# Altium schematic sheet atmega.SchDoc
size A4
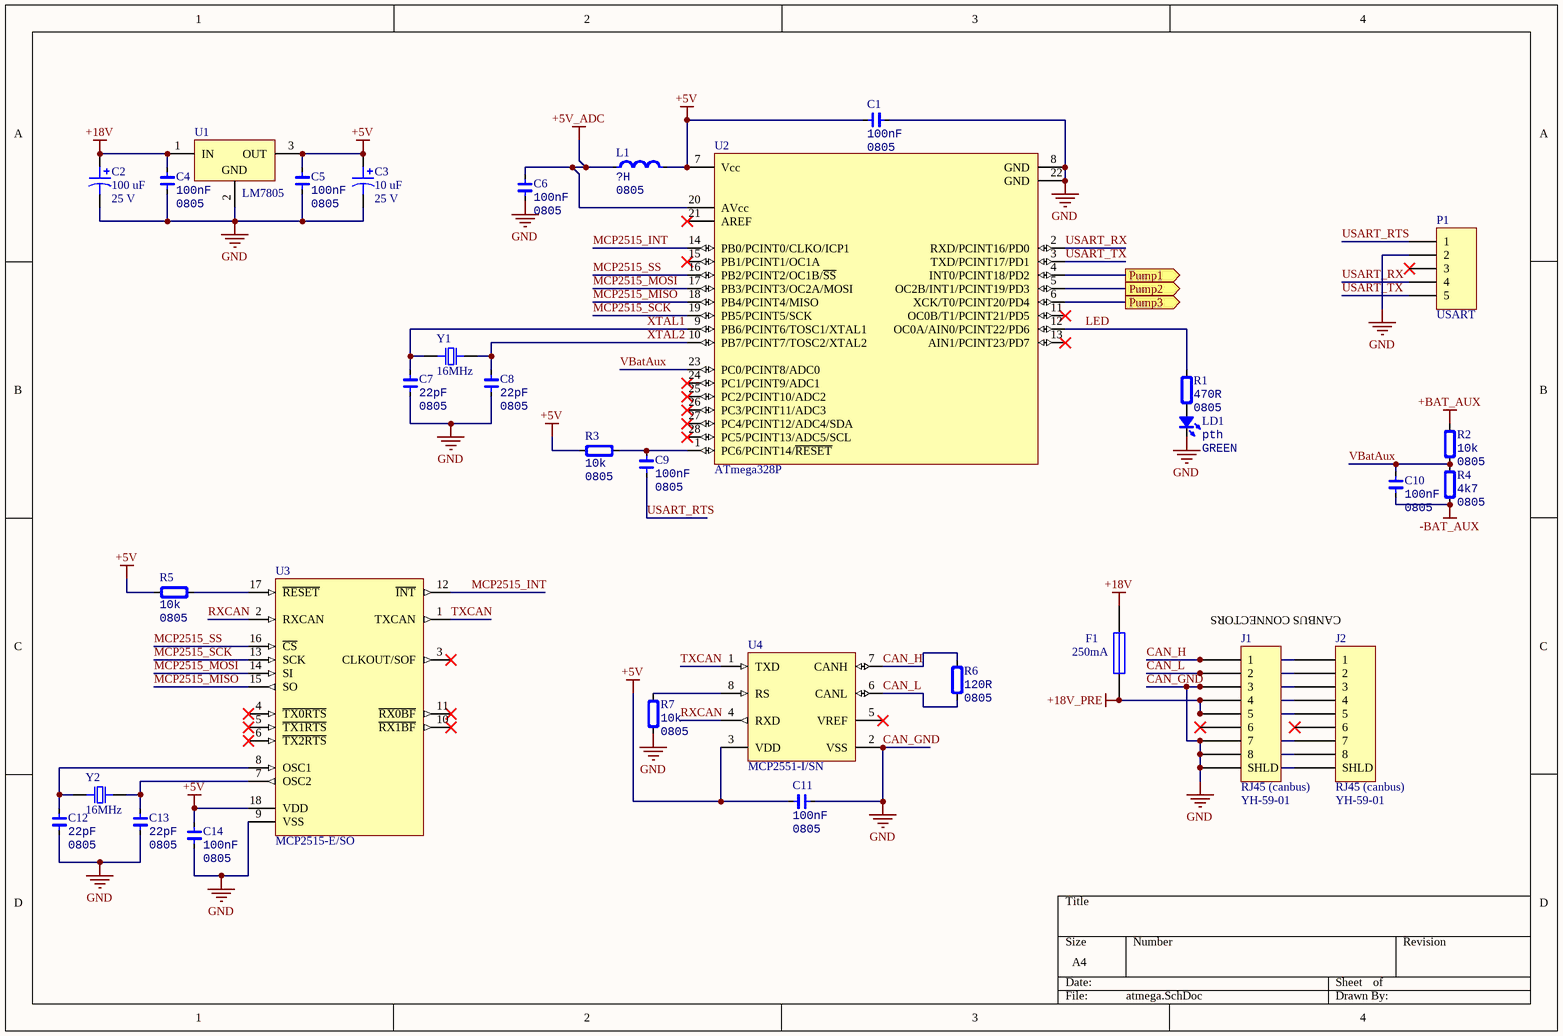
[diagram p0: atmega.SchDoc]

## Parts
C1  Type: 0805  [0805C]  (hidden comment: 100nF)
C2  Voltage: 25 V  [CP3.5mm-8.0mm]  (hidden comment: 100 uF)
C3  Voltage: 25 V  [CP3.5mm-8.0mm]  (hidden comment: 10 uF)
C4  Type: 0805  [0805C]  (hidden comment: 100nF)
C5  Type: 0805  [0805C]  (hidden comment: 100nF)
C6  Type: 0805  [0805C]  (hidden comment: 100nF)
C7  Type: 0805  [0805C]  (hidden comment: 22pF)
C8  Type: 0805  [0805C]  (hidden comment: 22pF)
C9  Type: 0805  [0805C]  (hidden comment: 100nF)
C10  Type: 0805  [0805C]  (hidden comment: 100nF)
C11  Type: 0805  [0805C]  (hidden comment: 100nF)
C12  Type: 0805  [0805C]  (hidden comment: 22pF)
C13  Type: 0805  [0805C]  (hidden comment: 22pF)
C14  Type: 0805  [0805C]  (hidden comment: 100nF)
F1  250mA  [Porta Fusivel]
J1  RJ45 (canbus)  value YH-59-01  [ASSMANN A-2004-2-4-LP/FS]
J2  RJ45 (canbus)  value YH-59-01  [ASSMANN A-2004-2-4-LP/FS]
L1  Type: 0805  [0805L]  (hidden comment: ?H)
LD1  Type: pth  [LED3MM]  (hidden comment: GREEN)
P1  USART  [HDR1X5]
R1  Type: 0805  [0805R]  (hidden comment: 470R)
R2  Type: 0805  [0805R]  (hidden comment: 10k)
R3  Type: 0805  [0805R]  (hidden comment: 10k)
R4  Type: 0805  [0805R]  (hidden comment: 4k7)
R5  Type: 0805  [0805R]  (hidden comment: 10k)
R6  Type: 0805  [0805R]  (hidden comment: 120R)
R7  Type: 0805  [0805R]  (hidden comment: 10k)
U1  LM7805  [TO220_deitado]
U2  ATmega328P  [DIP28-300(100)]
U3  MCP2515-E/SO  [WSO18_L]
U4  MCP2551-I/SN  [SOIC08-150(50)]
Y1  16MHz  [HC49-US-THT]
Y2  16MHz  [HC49-US-THT]

## Ports
Pump1 (out), Pump2 (out), Pump3 (out)

## Nets
+5V: C1.1 C3.1 C5.2 C11.1 C14.1 L1.2 R3.1 R5.1 U1.3(OUT) U2.7(Vcc) U3.18(VDD) U4.3(VDD)
+5V_ADC: C6.2 L1.1 U2.20(AVcc)
+18V: C2.1 C4.2 F1.1 U1.1(IN)
+18V_PRE: F1.2 J1.4 J1.5 J2.4 J2.5
+BAT_AUX: R2.2
-BAT_AUX: C10.1 R4.1
CAN_GND: C1.2 C2.2 C3.2 C4.1 C5.1 C6.1 C7.1 C8.1 C11.2 C12.1 C13.1 C14.2 J1.3 J1.7 J1.8 J1.S(SHLD) J2.3 J2.7 J2.8 J2.S(SHLD) LD1.2(K) P1.2 R7.2 U1.2(GND) U2.8(GND) U2.22(GND) U3.9(VSS) U4.2(VSS)  [also labelled GND]
CAN_H: J1.1 J2.1 R6.2 U4.7(CANH)
CAN_L: J1.2 J2.2 R6.1 U4.6(CANL)
LED: R1.2 U2.12(OC0A/AIN0/PCINT22/PD6)
MCP2515_INT: U2.14(PB0/PCINT0/CLKO/ICP1) U3.12(~{INT})
MCP2515_MISO: U2.18(PB4/PCINT4/MISO) U3.15(SO)
MCP2515_MOSI: U2.17(PB3/PCINT3/OC2A/MOSI) U3.14(SI)
MCP2515_SCK: U2.19(PB5/PCINT5/SCK) U3.13(SCK)
MCP2515_SS: U2.16(PB2/PCINT2/OC1B/~{SS}) U3.16(~{CS})
Pump1: U2.4(INT0/PCINT18/PD2) ; port Pump1
Pump2: U2.5(OC2B/INT1/PCINT19/PD3) ; port Pump2
Pump3: U2.6(XCK/T0/PCINT20/PD4) ; port Pump3
RXCAN: U3.2(RXCAN) U4.4(RXD)
TXCAN: U3.1(TXCAN) U4.1(TXD)
USART_RTS: C9.2 P1.1
USART_RX: P1.4 U2.2(RXD/PCINT16/PD0)
USART_TX: P1.5 U2.3(TXD/PCINT17/PD1)
VBatAux: C10.2 R2.1 R4.2 U2.23(PC0/PCINT8/ADC0)
XTAL1: C7.2 U2.9(PB6/PCINT6/TOSC1/XTAL1) Y1.1
XTAL2: C8.2 U2.10(PB7/PCINT7/TOSC2/XTAL2) Y1.2
NetC9_1: C9.1 R3.2 U2.1(PC6/PCINT14/~{RESET})
NetC12_2: C12.2 U3.8(OSC1) Y2.1
NetC13_2: C13.2 U3.7(OSC2) Y2.2
NetLD1_1: LD1.1(A) R1.1
NetR5_2: R5.2 U3.17(~{RESET})
NetR7_1: R7.1 U4.8(RS)

Not connected (* = marked no-connect by the designer): J1 6*; J2 6*; P1 3*; U2 11(OC0B/T1/PCINT21/PD5)* 13(AIN1/PCINT23/PD7)* 15(PB1/PCINT1/OC1A)* 21(AREF)* 24(PC1/PCINT9/ADC1)* 25(PC2/PCINT10/ADC2)* 26(PC3/PCINT11/ADC3)* 27(PC4/PCINT12/ADC4/SDA)* 28(PC5/PCINT13/ADC5/SCL)*; U3 3(CLKOUT/SOF)* 4(~{TX0RTS})* 5(~{TX1RTS})* 6(~{TX2RTS})* 10(~{RX1BF})* 11(~{RX0BF})*; U4 5(VREF)*

## Notes on the sheet
- CANBUS CONNECTORS

## Library data of the parts
C1 C4-C14 = Cap_0805: Capacitor
  C1 C4-C6 C9-C11 C14: Value: 100nF
  C7 C8 C12 C13: Value: 22pF
C2 C3 = CapacitorPol: Solid Aluminum Capacitor with Organic Semiconductor Electrolyte: 100uF, 10V, Bulk Pack; PackageReference: E
  C2: Value: 100 uF
  C3: Value: 10 uF
F1 = Fuse 1: Fuse; Type: 5x20; PackageReference: PIN-W2/E2.8; Value: 250mA
J1 J2 = Modular Jack with Shield: YH-59-01; Type: RJ45
L1 = Ind_0805: Inductor; Value: ?H
LD1 = LED_0805: LED; Value: GREEN
P1 = Header 5: Header, 5-Pin; Type: KRE
R1-R7 = Res_0805: Resistor
  R1: Value: 470R
  R2 R3 R5 R7: Value: 10k
  R4: Value: 4k7
  R6: Value: 120R
U1 = µA7805CKC: Positive-Voltage Regulator; PackageReference: KC03
U2 = ATmega328P: 8-bit AVR Microcontroller, 32KB Flash, 1KB EEPROM, 2KB SRAM, 28-pin PDIP, Industrial Grade (-40°C to 85°C); PackageReference: 28P3
U3 = CMP-0186-00035-2: Stand-Alone CAN Controller With SPI Interface, 18-Pin SOIC, Extended Temperature; PackageReference: SOIC-SO18; Type: SOIC-SO18; Value: MCP2515-E/SO
U4 = CMP-1721-00003-1: PackageReference: SN8; Type: SN8; Value: MCP2551-I/SN
Y1 Y2 = Crystal: Type: pth; Value: 16MHz